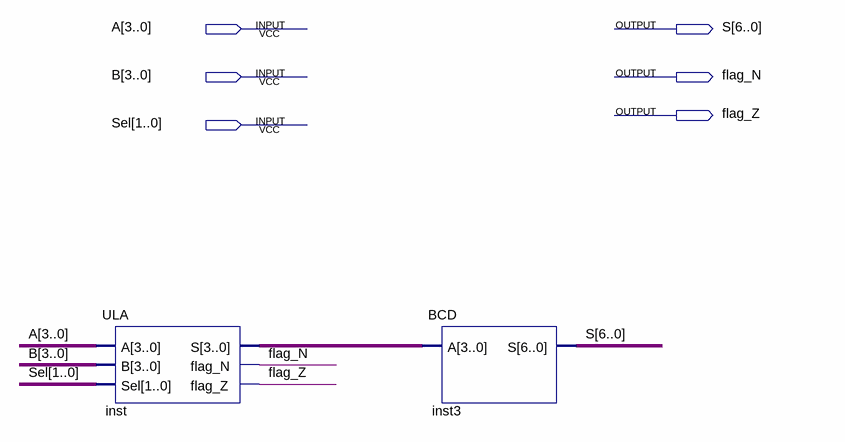
[diagram p0: schematic sheet]
// Quartus schematic ULA_BCD.bdf as structural Verilog: 2 symbols, 6 pins
module ULA_BCD (
  input  [3:0] A,
  input  [3:0] B,
  input  [1:0] Sel,
  output [6:0] S,
  output flag_N,
  output flag_Z
);

  wire [3:0] inst_s;

  ULA inst (.A(A), .B(B), .Sel(Sel), .S(inst_s), .flag_N(flag_N), .flag_Z(flag_Z));
  BCD inst3 (.A(inst_s), .S(S));
endmodule
